# Altium schematic sheet Sheet1.SchDoc: Arduino Uno
size A4; Author: Rubem Vasconcelos Pacelli; Engineer: Engenheiro Eletrônico; DocumentNumber: 2; Revision: 1.0; SheetNumber: 2; SheetTotal: 3
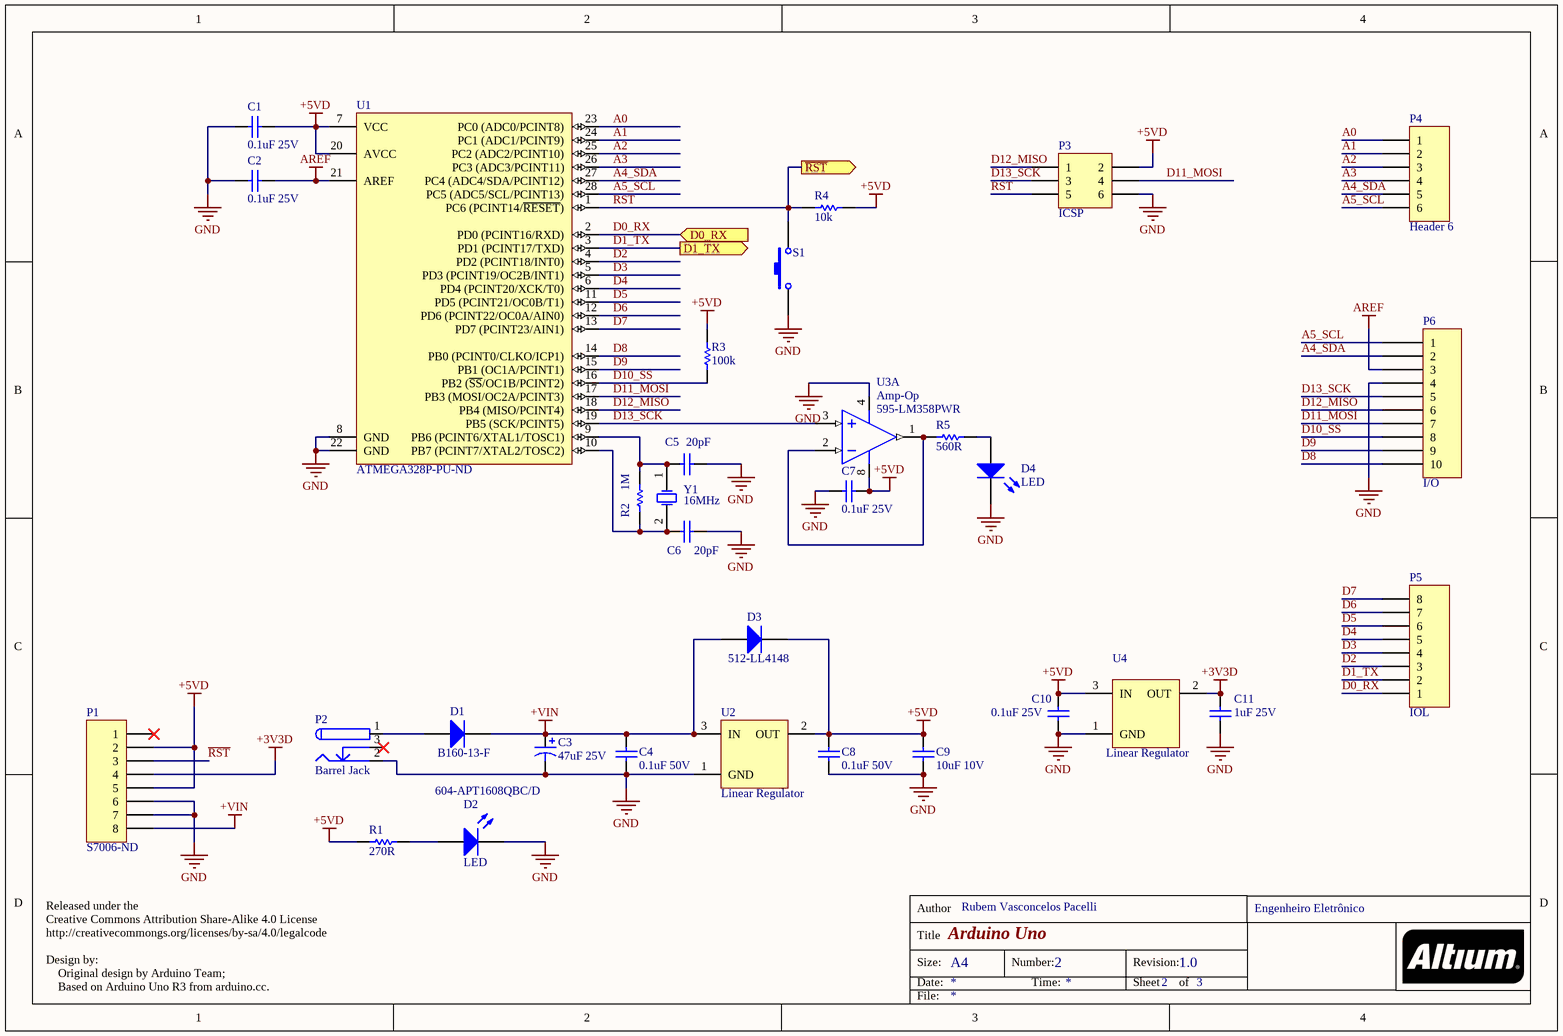
[diagram p0: Sheet1.SchDoc]

## Parts
C1  0.1uF 25V  [C1608[0603]]
C2  0.1uF 25V  [C1608[0603]]
C3  47uF 25V  [Cap_Al_SMD_C6_6.6x6.6mm]
C4  0.1uF 50V  [C1608[0603]]
C5  20pF  [C1608[0603]]
C6  20pF  [C1608[0603]]
C7  0.1uF 25V  [C1608[0603]]
C8  0.1uF 50V  [C1608[0603]]
C9  10uF 10V  [C2012[0805]]
C10  0.1uF 25V  [C1608[0603]]
C11  1uF 25V  [C2012[0805]]
D1  B160-13-F  [DO214AC]
D2  LED  Supplier Part Number 1: 604-APT1608QBC/D  [LED-0603-G]
D3  Supplier Part Number 1: 512-LL4148  [SOD-80/MLL34]
D4  LED  [LED-0603-R]
P1  Supplier Part Number 1: S7006-ND  [HDR1X8F]  (hidden comment: Header 8)
P2  Barrel Jack  [BARREL2.5]
P3  ICSP  [HDR2X3M]
P4  Header 6  [HDR1X6F]
P5  IOL  [HDR1X8F]
P6  I/O  [HDR1X10]
R1  270R  [R1608[0603]]
R2  1M  [R2012[0805]]
R3  100k  [R1608[0603]]
R4  10k  [R1608[0603]]
R5  560R  [R1608[0603]]
S1  (no value)  [PB-SW-SMT]
U1  Supplier Part Number 1: ATMEGA328P-PU-ND  [DIP28]  (hidden comment: ATmega328P-PU)
U2  Linear Regulator  [SOT223_N]
U3  Amp-Op  Supplier Part Number 1: 595-LM358PWR  [TSSOP8]  (part A of 2)
U4  Linear Regulator  [SOT223_N]
Y1  16MHz  [CRYSTAL-HC49/4H_SMX]

## Ports
D0_RX (in), D1_TX (out), ~{RST} (out)

## Nets
+3V3D: C11.2 P1.4 U4.2(OUT)
+5VD: C1.1 C7.1 C8.2 C9.2 C10.2 D3.2(K) P1.2 P1.5 P3.2 R1.1 R3.1 R4.1 U1.7(VCC) U1.20(AVCC) U2.2(OUT) U3.8(V+) U4.3(IN)
+VIN: C3.1 C4.2 D1.2(K) D3.1(A) P1.8 U2.3(IN)
AREF: C2.1 P6.3 U1.21(AREF)
GND: C1.2 C2.2 C3.2 C4.1 C5.2 C6.2 C7.2 C8.1 C9.1 C10.1 C11.1 D2.2(K) D4.2(K) P1.6 P1.7 P2.2 P3.6 P6.4 S1.1 U1.8(GND) U1.22(GND) U2.1(GND) U3.4(GND) U4.1(GND)
A0: P4.1 U1.23(PC0_(ADC0/PCINT8))
A1: P4.2 U1.24(PC1_(ADC1/PCINT9))
A2: P4.3 U1.25(PC2_(ADC2/PCINT10))
A3: P4.4 U1.26(PC3_(ADC3/PCINT11))
A4_SDA: P4.5 P6.2 U1.27(PC4_(ADC4/SDA/PCINT12))
A5_SCL: P4.6 P6.1 U1.28(PC5_(ADC5/SCL/PCINT13))
D0_RX: P5.1 U1.2(PD0_(PCINT16/RXD)) ; port D0_RX
D1_TX: P5.2 U1.3(PD1_(PCINT17/TXD)) ; port D1_TX
D2: P5.3 U1.4(PD2_(PCINT18/INT0))
D3: P5.4 U1.5(PD3_(PCINT19/OC2B/INT1))
D4: P5.5 U1.6(PD4_(PCINT20/XCK/T0))
D5: P5.6 U1.11(PD5_(PCINT21/OC0B/T1))
D6: P5.7 U1.12(PD6_(PCINT22/OC0A/AIN0))
D7: P5.8 U1.13(PD7_(PCINT23/AIN1))
D8: P6.10 U1.14(PB0_(PCINT0/CLKO/ICP1))
D9: P6.9 U1.15(PB1_(OC1A/PCINT1))
D10_SS: P6.8 R3.2 U1.16(PB2_(~{SS}/OC1B/PCINT2))
D11_MOSI: P3.4 P6.7 U1.17(PB3_(MOSI/OC2A/PCINT3))
D12_MISO: P3.1 P6.6 U1.18(PB4_(MISO/PCINT4))
D13_SCK: P3.3 P6.5 U1.19(PB5_(SCK/PCINT5)) U3.3(IN1+)
~{RST}: P1.3 P3.5 R4.2 S1.2 U1.1(PC6_(PCINT14/~{RESET})) ; port ~{RST}
NetC5_1: C5.1 R2.2 U1.9(PB6_(PCINT6/XTAL1/TOSC1)) Y1.1(OSC1)
NetC6_1: C6.1 R2.1 U1.10(PB7_(PCINT7/XTAL2/TOSC2)) Y1.2(OSC2)
NetD1_1: D1.1(A) P2.1
NetD2_1: D2.1(A) R1.2
NetD4_1: D4.1(A) R5.2
NetR5_1: R5.1 U3.1(OUT1) U3.2(IN1-)

Not connected (* = marked no-connect by the designer): P1 1*; P2 3*

## Notes on the sheet
- Released under the
  Creative Commons Attribution Share-Alike 4.0 License
  http://creativecommongs.org/licenses/by-sa/4.0/legalcode
  Design by:
  Original design by Arduino Team;
  Based on Arduino Uno R3 from arduino.cc.
- Author
- Title
- Size:
- Date:
- A4
- Number:
- Time:
- Revision:
- Sheet
- of
- File:

## Library data of the parts
C1 C2 C7 C10 = C: Capacitor Decoupling; Manufacturer Part Number: GCM188R71E104KA57D; Value: 1; Capacitance: 100nF; Tolerance: 10%; Dielectric: X7R; Manufacturer: *; PartNumber: *; Package Type: *; Supplier 1: Digi-Key; Supplier Part Number 1: GCM188R71E104KA57D-ND; Stock 1: 0; Mount: Surface Mount; Case/Package: 0603; Case Code (Imperial): 0603; Case Code (Metric): 1608; Min Operating Temperature: -55°C; Max Operating Temperature: 125°C; Packaging: Tape and Reel; Voltage Rating: 25V; Voltage Rating (DC): 25V; Package Quantity: 4000; Termination: SMD/SMT; Voltage: 25V; Length: 1.6mm; Height: 0.8mm; Width: 0.8mm; Thickness: 0.035inch; Depth: 0.8mm; Ratings: AEC-Q200; Radiation Hardening: No; Lead Free: Lead Free
C3 = CP: Polarized Capacitor - Power Entry; Manufacturer Part Number: EEE-HA1E470WP; Tolerance: 20%; Ripple Current: 70mA; Life (Hours): 1000Hour; Leakage Current: 11.7uA; Lead Diameter: 0.65mm; Manufacturer: *; PartNumber: *; Package Type: *; Value: *; Supplier 1: Digi-Key; Supplier Part Number 1: PCE4206DKR-ND; Stock 1: 156126; Pricing 1: 1=0.43, 10=0.301, 100=0.1808, 500=0.13558 (USD); Mount: Surface Mount; Case/Package: Radial; Contact Plating: Tin; Min Operating Temperature: -40°C; Max Operating Temperature: 105°C; Capacitance: 47uF; Ripple Current (AC): 70mA; Voltage Rating: 25V; Packaging: Tape and Reel; Package Quantity: 1; Voltage Rating (DC): 25V; Termination: SMD/SMT; Voltage: 25V; Diameter: 6.3mm; Length: 5.5mm; Height: 5.4mm; Lead Pitch: 1.8mm; Height - Seated (Max): 0.213inch; Width: 650um; Radiation Hardening: No; REACH SVHC: Unknown; Lead Free: Lead Free; ComponentLink1URL: http://uk.rs-online.com/webdocs/102e/0900766b8102e3f9.pdf; ComponentLink1Description: http://uk.rs-online.com/webdocs/102e/0900766b8102e3f9.pdf; ComponentLink2URL: http://industrial.panasonic.com/www-data/pdf/ABA0000/ABA0000CE3.pdf; ComponentLink2Description: http://industrial.panasonic.com/www-data/pdf/ABA0000/ABA0000CE3.pdf; ComponentLink3URL: http://www.farnell.com/datasheets/1446029.pdf; ComponentLink3Description: http://www.farnell.com/datasheets/1446029.pdf; ComponentLink4URL: http://www.farnell.com/datasheets/2059663.pdf; ComponentLink4Description: http://www.farnell.com/datasheets/2059663.pdf; ComponentLink5URL: https://www.alliedelec.com/m/d/7ecf71cebe655f70ab90926cc286bede.pdf; ComponentLink5Description: https://www.alliedelec.com/m/d/7ecf71cebe655f70ab90926cc286bede.pdf; ComponentLink6URL: http://www.jameco.com/Jameco/Products/ProdDS/1984291.pdf; ComponentLink6Description: http://www.jameco.com/Jameco/Products/ProdDS/1984291.pdf
C4 = C: Decoupling Capacitor; Manufacturer Part Number: C1608X7R1H104M080AA; Value: 1; Dielectric Material: Ceramic; Capacitance: 100nF; Tolerance: 20%; Dielectric: X7R; Manufacturer: *; PartNumber: *; Package Type: *; Supplier 1: Digi-Key; Supplier Part Number 1: 445-5098-6-ND; Stock 1: 0; Pricing 1: 1=0.1, 10=0.074, 100=0.0331, 500=0.02366, 1000=0.0186 (USD); Mount: Surface Mount; Case/Package: 0603; Number of Pins: 2; Weight: 7.1E-05oz; Case Code (Metric): 1608; Case Code (Imperial): 0603; Min Operating Temperature: -55°C; Max Operating Temperature: 125°C; Package Quantity: 1; Voltage Rating: 50V; Packaging: Tape and Reel; Voltage Rating (DC): 50V; Termination: SMD/SMT; Composition: Ceramic; Length: 1.6mm; Height: 0.8mm; Width: 0.031inch; Depth: 0.8mm; Thickness: 0.037inch; Radiation Hardening: No; REACH SVHC: No SVHC; Lead Free: Lead Free; ComponentLink1URL: http://www.farnell.com/datasheets/1571323.pdf; ComponentLink1Description: http://www.farnell.com/datasheets/1571323.pdf; ComponentLink2URL: https://product.tdk.com/info/en/catalog/spec/mlccspec_commercial_general_midvoltage_en.pdf; ComponentLink2Description: https://product.tdk.com/info/en/catalog/spec/mlccspec_commercial_general_midvoltage_en.pdf; ComponentLink3URL: http://www.tdk.co.jp/tefe02/e412_c.pdf; ComponentLink3Description: http://www.tdk.co.jp/tefe02/e412_c.pdf
C5 C6 = C: Capacitor Crystal; Manufacturer Part Number: CL10C200JB8NNNC; Value: 1; Tolerance: 5%; Dielectric: C0G; Voltage Rating: 50V; Temperature Coefficient: 300ppm/°C; Manufacturer: *; PartNumber: *; Package Type: *; Supplier 1: Digi-Key; Supplier Part Number 1: 1276-1187-6-ND; Stock 1: 40000; Pricing 1: 1=0.1, 10=0.048, 100=0.0214, 500=0.01532, 1000=0.01203 (USD); Mount: Surface Mount; Case/Package: 0603; Case Code (Metric): 1608; Case Code (Imperial): 0603; Min Operating Temperature: -55°C; Max Operating Temperature: 125°C; Capacitance: 20pF; Package Quantity: 1; Packaging: Tape and Reel; Voltage: 50V; Length: 1.6mm; Height: 0.8mm; Width: 0.031inch; Thickness: 0.035inch; Depth: 0.8mm; Radiation Hardening: No
C8 = C: Capacitor Decoupling; Manufacturer Part Number: C1608X7R1H104M080AA; Value: 1; Dielectric Material: Ceramic; Capacitance: 100nF; Tolerance: 20%; Dielectric: X7R; Manufacturer: *; PartNumber: *; Package Type: *; Supplier 1: Digi-Key; Supplier Part Number 1: 445-5098-6-ND; Stock 1: 0; Pricing 1: 1=0.1, 10=0.074, 100=0.0331, 500=0.02366, 1000=0.0186 (USD); Mount: Surface Mount; Case/Package: 0603; Number of Pins: 2; Weight: 7.1E-05oz; Case Code (Metric): 1608; Case Code (Imperial): 0603; Min Operating Temperature: -55°C; Max Operating Temperature: 125°C; Package Quantity: 1; Voltage Rating: 50V; Packaging: Tape and Reel; Voltage Rating (DC): 50V; Termination: SMD/SMT; Composition: Ceramic; Length: 1.6mm; Height: 0.8mm; Width: 0.031inch; Depth: 0.8mm; Thickness: 0.037inch; Radiation Hardening: No; REACH SVHC: No SVHC; Lead Free: Lead Free; ComponentLink1URL: http://www.farnell.com/datasheets/1571323.pdf; ComponentLink1Description: http://www.farnell.com/datasheets/1571323.pdf; ComponentLink2URL: https://product.tdk.com/info/en/catalog/spec/mlccspec_commercial_general_midvoltage_en.pdf; ComponentLink2Description: https://product.tdk.com/info/en/catalog/spec/mlccspec_commercial_general_midvoltage_en.pdf; ComponentLink3URL: http://www.tdk.co.jp/tefe02/e412_c.pdf; ComponentLink3Description: http://www.tdk.co.jp/tefe02/e412_c.pdf
C9 = C: Capacitor Decoupling; Manufacturer Part Number: C1608JB1A106K080AC; Value: 1; Dielectric Material: Ceramic; Tolerance: 10%; Manufacturer: *; PartNumber: *; Package Type: *; Supplier 1: Digi-Key; Supplier Part Number 1: 445-11201-6-ND; Stock 1: 22257; Pricing 1: 1=0.62, 10=0.431, 100=0.2588, 500=0.19406, 1000=0.16388 (USD); Mount: Surface Mount; Case/Package: 0603; Case Code (Metric): 1608; Case Code (Imperial): 0603; Min Operating Temperature: -25°C; Max Operating Temperature: 85°C; Package Quantity: 4000; Packaging: Tape and Reel; Capacitance: 10uF; Voltage Rating: 10V; Termination: SMD/SMT; Composition: Ceramic; Voltage Rating (DC): 10V; Length: 0.063inch; Height: 0.8mm; Width: 0.8mm; Thickness: 0.035inch; Lead Free: Lead Free; ComponentLink1URL: https://product.tdk.com/en/products/common/pdf/mlcc_partnumber_description.pdf; ComponentLink1Description: https://product.tdk.com/en/products/common/pdf/mlcc_partnumber_description.pdf
C11 = C: Capacitor Decoupling; Manufacturer: TDK; Manufacturer Part Number: C2012X7R1E105K125AB; Dielectric Material: Ceramic; Tolerance: 10%; Dielectric: X7R; Supplier 1: Digi-Key; Supplier Part Number 1: 445-1354-1-ND; Stock 1: 0; Pricing 1: 1=0.16, 10=0.115, 100=0.054, 500=0.0379, 1000=0.03137 (USD); Mount: Surface Mount; Case/Package: 0805; Number of Pins: 2; Weight: 0.000194oz; Case Code (Imperial): 0805; Case Code (Metric): 2012; Min Operating Temperature: -55°C; Max Operating Temperature: 125°C; Voltage Rating: 25V; Packaging: Tape and Reel; Capacitance: 1uF; Voltage Rating (DC): 25V; Package Quantity: 1; Termination: SMD/SMT; Voltage: 25V; Composition: Ceramic; Length: 2mm; Height: 1.25mm; Width: 1.25mm; Thickness: 0.057inch; Depth: 1.25mm; Radiation Hardening: No; Lead Free: Lead Free; REACH SVHC: No SVHC
D1 = D: Diode; Peak Reverse Current: 500uA; Forward Current: 1A; Max Repetitive Reverse Voltage (Vrrm): 60V; Peak Non-Repetitive Surge Current: 30A; Element Configuration: Single; Forward Voltage: 700mV; Polarity: Standard; Capacitance: 110pF; Manufacturer: *; PartNumber: *; Package Type: *; Supplier 1: Digi-Key; Supplier Part Number 1: B160-FDIDKR-ND; Manufacturer Part Number: B160-13-F; Stock 1: 242650; Pricing 1: 1=0.37, 10=0.304, 100=0.1615, 500=0.10622, 1000=0.07223 (USD); Mount: Surface Mount; Case/Package: SMA; Number of Pins: 2; Weight: 0.002258oz; Contact Plating: Matte,Tin; Min Operating Temperature: -65°C; Max Operating Temperature: 150°C; Package Quantity: 5000; Packaging: Tape and Reel; Average Rectified Current: 1A; Max Forward Surge Current (Ifsm): 30A; Termination: SMD/SMT; Voltage Rating (DC): 60V; Current Rating: 1A; Output Current: 1A; Max Reverse Voltage (DC): 60V; Length: 4.6mm; Height: 2.1mm; Width: 2.92mm; Radiation Hardening: No; REACH SVHC: No SVHC; Lead Free: Lead Free; ComponentLink1URL: https://www.diodes.com/assets/Datasheets/ds13002.pdf; ComponentLink1Description: https://www.diodes.com/assets/Datasheets/ds13002.pdf; ComponentLink2URL: http://www.farnell.com/datasheets/1911815.pdf; ComponentLink2Description: http://www.farnell.com/datasheets/1911815.pdf; ComponentLink3URL: http://www.diodes.com/datasheets/ds13002.pdf; ComponentLink3Description: http://www.diodes.com/datasheets/ds13002.pdf; ComponentLink4URL: http://www.diodes.com///datasheets/ds13002.pdf; ComponentLink4Description: http://www.diodes.com///datasheets/ds13002.pdf
D2 = LED: LED indicador visual; Manufacturer: Kingbright; Manufacturer Part Number: APT1608QBC/D; Color: Blue; Lens Color: Clear,Colorless; Luminous Intensity: 100mcd; Viewing Angle: 120°; Lens Style: Clear,Flat; Forward Current: 20mA; Forward Voltage: 3.3V; Lens Transparency: Clear; Dominant Wavelength: 465nm; Number of LEDs: 1; PartNumber: *; Package Type: *; Supplier 1: Mouser; Stock 1: 33663; Pricing 1: 1=0.49, 10=0.35, 50=0.35, 100=0.229, 1000=0.129, 10000=0.091 (USD); Mount: Surface Mount; Case/Package: 0603; Number of Pins: 2; Case Code (Metric): 1608; Case Code (Imperial): 0603; Min Operating Temperature: -40°C; Max Operating Temperature: 85°C; Package Quantity: 2000; Packaging: Tape and Reel; Illumination Color: Blue; Test Current: 20mA; Length: 1.6mm; Height: 0.75mm; Width: 0.8mm; Lead Free: Lead Free; ComponentLink1URL: http://www.kingbrightusa.com/images/catalog/SPEC/APT1608QBC-D.pdf; ComponentLink1Description: http://www.kingbrightusa.com/images/catalog/SPEC/APT1608QBC-D.pdf; ComponentLink2URL: http://www.mouser.com/ds/2/216/APT1608QBC-D-65281.pdf; ComponentLink2Description: http://www.mouser.com/ds/2/216/APT1608QBC-D-65281.pdf
D3 = D: Diode Protection; Manufacturer Part Number: LL4148; Max Surge Current: 2A; Forward Voltage: 1V; Forward Current: 200mA; Peak Reverse Current: 25nA; Recovery Time: 4ns; Max Repetitive Reverse Voltage (Vrrm): 100V; Power Dissipation: 500mW; Element Configuration: Single; Manufacturer: *; PartNumber: *; Package Type: *; Supplier 1: Mouser; Stock 1: 987975; Pricing 1: 1=0.1, 10=0.087, 50=0.087, 100=0.031, 1000=0.021, 10000=0.014 (USD); Mount: Surface Mount; Number of Pins: 2; Weight: 0.01lb; Contact Plating: Matte,Tin; Min Operating Temperature: -65°C; Max Operating Temperature: 175°C; Packaging: Tape and Reel; Package Quantity: 1; Average Rectified Current: 200mA; Reverse Recovery Time: 4ns; Peak Non-Repetitive Surge Current: 2A; Max Forward Surge Current (Ifsm): 2A; Voltage: 100V; Max Reverse Voltage (DC): 100V; Reverse Voltage: 100V; Current: 2A; Length: 3.6mm; Height: 1.5mm; Width: 1.5mm; Radiation Hardening: No; REACH SVHC: No SVHC; Lead Free: Lead Free; ComponentLink1URL: http://www.farnell.com/datasheets/1730036.pdf; ComponentLink1Description: http://www.farnell.com/datasheets/1730036.pdf; ComponentLink2URL: https://www.fairchildsemi.com/datasheets/LL/LL4148.pdf; ComponentLink2Description: https://www.fairchildsemi.com/datasheets/LL/LL4148.pdf; ComponentLink3URL: http://www.jameco.com/Jameco/Products/ProdDS/94908.pdf; ComponentLink3Description: http://www.jameco.com/Jameco/Products/ProdDS/94908.pdf; ComponentLink4URL: http://www.mouser.com/ds/2/149/LL4148-70504.pdf; ComponentLink4Description: http://www.mouser.com/ds/2/149/LL4148-70504.pdf; ComponentLink5URL: http://www.farnell.com/datasheets/2037793.pdf; ComponentLink5Description: http://www.farnell.com/datasheets/2037793.pdf; ComponentLink6URL: https://www.verical.com/server-webapp/html/getDatasheet?partID=110057; ComponentLink6Description: https://www.verical.com/server-webapp/html/getDatasheet?partID=110057; ComponentLink7URL: http://www.farnell.com/datasheets/1896420.pdf; ComponentLink7Description: http://www.farnell.com/datasheets/1896420.pdf
D4 = LED: Manufacturer Part Number: LTST-C191KRKT; Colour: Red; Lens Colour: Colorless; Power Rating: 75mW; Luminous Intensity: 54mcd; Viewing Angle: 130°; Forward Voltage: 2V; Lens Style: Clear,Colorless,Diffused,Rectangular; Forward Current: 30mA; Dominant Wavelength: 631nm; Test Current: 20mA; Lens Transparency: Clear; Number of Elements: 1; Wavelength: 639nm; Reverse Voltage: 5V; Current: 2A; Manufacturer: *; PartNumber: *; Package Type: *; Supplier 1: Digi-Key; Supplier Part Number 1: 160-1447-6-ND; Stock 1: 978989; Pricing 1: 1=0.29, 10=0.211, 25=0.1556, 100=0.1111, 250=0.07556, 500=0.06666, 1000=0.05222, 2500=0.05111 (USD); Mount: Surface Mount; Case/Package: 0603; Number of Pins: 2; Case Code (Metric): 1608; Case Code (Imperial): 0603; Min Operating Temperature: -55°C; Max Operating Temperature: 85°C; Packaging: Tape and Reel; Package Quantity: 1; Illumination Colour: Red; Power Dissipation: 75mW; Number of LEDs: 1; Voltage: 2V; Length: 1.6mm; Height: 0.55mm; Width: 0.8mm; Depth: 0.8mm; Radiation Hardening: No; Lead Free: Lead Free
P1 P5 = Header 8: Header, 8-Pin; Manufacturer: Sullins; Manufacturer Part Number: PPTC081LFBN-RC; Number of Positions: 8; Connector Type: Header,Socket; Pitch: 0.1inch; LatestRevisionDate: 17-Jul-2002; LatestRevisionNote: Re-released for DXP Platform.; Publisher: Altium Limited; Supplier 1: Digi-Key; Pricing 1: 1=0.65, 10=0.608, 400=0.42525, 800=0.3645, 1200=0.33413, 5200=0.29363, 10000=0.2925 (USD); Mount: Through Hole; Contact Plating: Tin; Contact Material: Bronze; Housing Material: Plastic; Package Quantity: 1000; Number of Rows: 1; Packaging: Bulk; Termination: Solder; Length: 20.8mm; Height: 8.5mm; Width: 2.5mm; Lead Free: Lead Free
  P1: Stock 1: 55095; Color: Black
  P5: Supplier Part Number 1: S7006-ND; Stock 1: 21933; Colour: Black
P2 = PWR2.5: Low Voltage Power Supply Connector; Manufacturer: Memory Protection Devices; Manufacturer Part Number: EJ503A; Pricing 1: 1=2.7, 10=2.447, 100=2.0977, 500=1.74806, 1000=1.49834 (USD); Stock 1: 1084; Supplier 1: Digi-Key; Supplier Part Number 1: EJ503A-ND; Mount: Through Hole
P3 = Header 3X2: Header, 3-Pin, Dual row; Manufacturer: Harwin; Manufacturer Part Number: M20-9720345; Max Current Rating: 3A; Contact Resistance: 25mR; Number of Positions: 6; Gender: Male; Connector Type: Male Pin; Pitch: 2.54mm; Row Spacing: 0.1inch; LatestRevisionDate: 17-Jul-2002; LatestRevisionNote: Re-released for DXP Platform.; Publisher: Altium Limited; Supplier 1: Digi-Key; Supplier Part Number 1: 952-1921-ND; Stock 1: 4637; Pricing 1: 1=0.33, 10=0.308, 100=0.2156, 500=0.1848, 1000=0.154, 5000=0.132, 10000=0.1232 (USD); Mount: Through Hole; Contact Plating: Gold; Colour: Black; Contact Material: Brass; Housing Colour: Black; Housing Material: Nylon; Min Operating Temperature: -40°C; Max Operating Temperature: 105°C; Package Quantity: 1000; Packaging: Bulk; Termination: Solder; Number of Rows: 2; Number of Contacts: 6; Orientation: Straight; Length: 7.62mm; Depth: 5.08mm; Contact Mating Length: 0.276inch; Radiation Hardening: No
P4 = Header 6: Header, 6-Pin; LatestRevisionDate: 17-Jul-2002; LatestRevisionNote: Re-released for DXP Platform.; Publisher: Altium Limited
P6 = Header 10: Header, 10-Pin; Manufacturer: Sullins; Manufacturer Part Number: PPTC101LFBN-RC; Number of Positions: 10; Connector Type: Header,Socket; Pitch: 0.1inch; Supplier 1: Digi-Key; Supplier Part Number 1: S7008-ND; Stock 1: 22268; Pricing 1: 1=0.65, 10=0.574, 320=0.45, 640=0.405, 1280=0.36, 5120=0.325 (USD); Mount: Through Hole; Color: Black; Contact Plating: Tin; Contact Material: Bronze; Housing Material: Plastic; Package Quantity: 1000; Number of Rows: 1; Packaging: Bulk; Termination: Solder; Length: 25.9mm; Height: 8.5mm; Width: 2.5mm; Lead Free: Lead Free
R1 = R: Resistor; Manufacturer: Rohm Semiconductor; Manufacturer Part Number: ESR03EZPJ271; Value: 0; Tolerance: 5%; Max Power Dissipation: 250mW; Temperature Coefficient: 200ppm/°C; PartNumber: *; Package Type: *; Supplier 1: Mouser; Supplier Part Number 1: 755-ESR03EZPJ271; Stock 1: 13313; Pricing 1: 1=0.1, 10=0.071, 50=0.071, 100=0.025, 1000=0.017, 10000=0.011 (USD); Case/Package: 0603; Case Code (Metric): 1608; Case Code (Imperial): 0603; Min Operating Temperature: -55°C; Max Operating Temperature: 155°C; Package Quantity: 5000; Packaging: Cut Tape; Resistance: 270R; Composition: Thick Film; Number of Terminations: 2; Features: Automotive AEC-Q200; Length: 0.063inch; Height: 0.022inch; Width: 0.031inch; ComponentLink1URL: http://www.rohm.com/web/global/datasheet/ESR01MZPF/esr-e; ComponentLink1Description: http://www.rohm.com/web/global/datasheet/ESR01MZPF/esr-e; Mount: Surface Mount
R2 = R: Resistor; Manufacturer Part Number: ERA-6AEB105V; Value: 0; Resistance: 1MR; Tolerance: 1%; Temperature Coefficient: 25ppm/°C; Voltage Rating: 100V; Power Rating: 125mW; Manufacturer: *; PartNumber: *; Package Type: *; Supplier 1: Digi-Key; Supplier Part Number 1: P1MDADKR-ND; Stock 1: 150805; Pricing 1: 1=0.36, 10=0.302, 100=0.1182, 1000=0.04948, 2500=0.04536 (USD); Mount: Surface Mount; Case/Package: 0805; Number of Pins: 2; Contact Plating: Tin; Case Code (Imperial): 0805; Case Code (Metric): 2012; Min Operating Temperature: -55°C; Max Operating Temperature: 155°C; Composition: Thin Film; Packaging: Tape and Reel; Package Quantity: 1; Number of Terminations: 2; Military Standard: Not; Termination: Solder; Max Power Dissipation: 125mW; Voltage Rating (DC): 100V; Working Voltage: 100V; Features: Automotive AEC-Q200; Length: 2mm; Height: 0.5mm; Width: 1.25mm; Depth: 1.25mm; Radiation Hardening: No; REACH SVHC: No SVHC; Lead Free: Lead Free
R3 = R: Resistor pull-up; Manufacturer Part Number: MCT06030C1003FP500; Value: 0; Resistance: 100kR; Tolerance: 1%; Temperature Coefficient: 50ppm/°C; Power Rating: 100mW; Voltage Rating: 75V; Max Power Dissipation: 125mW; Manufacturer: *; PartNumber: *; Package Type: *; Supplier 1: Digi-Key; Supplier Part Number 1: MCT0603-100K-CFDKR-ND; Stock 1: 0; Pricing 1: 1=0.18, 10=0.152, 100=0.0596, 1000=0.02495, 2500=0.02287 (USD); Mount: Surface Mount; Case/Package: 0603; Weight: 7.1E-05oz; Case Code (Metric): 1608; Case Code (Imperial): 0603; Contact Plating: Tin; Min Operating Temperature: -55°C; Max Operating Temperature: 125°C; Packaging: Tape and Reel; Composition: Thin Film; Voltage Rating (DC): 75V; Military Standard: Not; Package Quantity: 1; Number of Terminations: 2; Termination: SMD/SMT; Length: 1.55mm; Height: 0.022inch; Depth: 0.85mm; Width: 0.033inch; Radiation Hardening: No; REACH SVHC: Unknown; Lead Free: Lead Free
R4 = R: Resistor pull-up; Manufacturer Part Number: MCT06030C1002FP500; Value: 0; Resistance: 10kR; Power Rating: 100mW; Tolerance: 1%; Max Power Dissipation: 125mW; Voltage Rating: 75V; Temperature Coefficient: 50ppm/°C; Manufacturer: *; PartNumber: *; Package Type: *; Supplier 1: Digi-Key; Supplier Part Number 1: MCT0603-10.0K-CFDKR-ND; Stock 1: 1373195; Pricing 1: 1=0.18, 10=0.152, 100=0.0596, 1000=0.02495, 2500=0.02287 (USD); Mount: Surface Mount; Case/Package: 0603; Case Code (Imperial): 0603; Case Code (Metric): 1608; Contact Plating: Tin; Min Operating Temperature: -55°C; Max Operating Temperature: 125°C; Packaging: Tape and Reel; Package Quantity: 1; Composition: Thin Film; Military Standard: Not; Voltage Rating (DC): 75V; Number of Terminations: 2; Length: 1.55mm; Height: 0.022inch; Depth: 0.85mm; Width: 0.8mm; Radiation Hardening: No; REACH SVHC: Unknown; Lead Free: Lead Free
R5 = R: Resistor; Manufacturer Part Number: AC0603FR-07560RL; Value: 0; Tolerance: 1%; Voltage Rating: 50V; Power Rating: 100mW; Temperature Coefficient: 100ppm/°C; Manufacturer: *; PartNumber: *; Package Type: *; Supplier 1: Digi-Key; Supplier Part Number 1: YAG3618DKR-ND; Stock 1: 31951; Pricing 1: 1=0.1, 10=0.032, 100=0.0129, 1000=0.00579, 2500=0.00502 (USD); Case/Package: 0603; Weight: 7.1E-05oz; Case Code (Imperial): 0603; Case Code (Metric): 1608; Min Operating Temperature: -55°C; Max Operating Temperature: 155°C; Resistance: 560R; Packaging: Tape and Reel; Composition: Thick Film; Termination: SMD/SMT; Number of Terminations: 2; Max Power Dissipation: 100mW; Features: Automotive AEC-Q200,Moisture Resistant; Length: 0.063inch; Height: 0.022inch; Width: 0.8mm; Lead Free: Lead Free; Mount: Surface Mount
S1 = SW Tact: Tactile Switch; Manufacturer Part Number: PTS645SM43SMTR92LFS; Mechanical Life: 100000Cycles; Actuator Material: Nylon,Polyamide; Max Voltage Rating (DC): 12V; Throw Configuration: SPST; Contact Resistance: 100mR; Operating Force: 160gf; Max Current Rating: 50mA; Illumination Type: Illuminated,Non-Illuminated; Switch Function: Off-Mom; Actuator Type: Standard; Actuator Length: 0.85mm; Manufacturer: *; PartNumber: *; Package Type: *; Supplier 1: Digi-Key; Supplier Part Number 1: CKN9112DKR-ND; Stock 1: 477790; Pricing 1: 1=0.16, 10=0.157, 25=0.1516, 50=0.1462, 100=0.1381, 250=0.12996, 500=0.12452 (USD); Mount: Surface Mount; Case/Package: SMD/SMT; Contact Plating: Silver; Contact Material: Silver; Colour: Black; Min Operating Temperature: -20°C; Max Operating Temperature: 60°C; Packaging: Tape and Reel; Package Quantity: 1000; Current Rating: 50mA; Voltage Rating (DC): 12V; Termination: Gull Wing; Orientation: Straight; Length: 6mm; Depth: 9mm; REACH SVHC: No SVHC; Lead Free: Lead Free
U1 = ATmega328P-PU: 8-bit AVR Microcontroller, 32KB Flash, 1KB EEPROM, 2KB SRAM, 28-pin PDIP, Industrial Grade (-40°C to 85°C); Manufacturer: Microchip / Atmel; Number of PWM Channels: 6; Number of Timers/Counters: 3; Min Supply Voltage: 1.8V; Max Supply Voltage: 5.5V; Interface: 2-Wire,I2C,SPI,UART,USART; Number of I/Os: 23; Frequency: 20MHz; Oscillator Type: Internal; Data Bus Width: 8b; Number of SPI Channels: 1; Watchdog Timer: Yes; Peripherals: Brown-out Detect/Reset,POR,PWM,WDT; DatasheetVersion: revD, May-2011; PackageVersion: revB, Sep-2001; PackageReference: 28P3; PackageDescription: 28-lead (0.300"/7.62mm Wide) Plastic Dual Inline Package (PDIP); ComponentLink1Description: Manufacturer URL; ComponentLink1URL: http://www.atmel.com/; ComponentLink2Description: ATmega48A/48PA/88A/88PA/168A/168PA/328/328P Datasheet; ComponentLink2URL: http://www.atmel.com/dyn/resources/prod_documents/8271.pdf; ComponentLink3Description: ATmega48A/48PA/88A/88PA/168A/168PA/328/328P Summary; ComponentLink3URL: http://www.atmel.com/dyn/resources/prod_documents/8271S.pdf; Supplier 1: Digi-Key; Manufacturer Part Number: ATMEGA328P-PU; Stock 1: 12517; Pricing 1: 1=2.14, 25=1.9672, 100=1.7819 (USD); Mount: Through Hole; Case/Package: PDIP; Number of Pins: 28; Contact Plating: Matte,Tin; Min Operating Temperature: -40°C; Max Operating Temperature: 85°C; Package Quantity: 14; Core Architecture: AVR; RAM Size: 2KB; Number of ADC Channels: 6; Packaging: Rail/Tube; Number of Programmable I/O: 23; Max Frequency: 20MHz; Number of I2C Channels: 1; Memory Type: FLASH; Memory Size: 32KB; Length: 37.4mm; Height: 3.28mm; Width: 6.76mm; Radiation Hardening: No; REACH SVHC: No SVHC; Lead Free: Lead Free; ComponentLink4URL: http://www.farnell.com/datasheets/2047852.pdf; ComponentLink4Description: http://www.farnell.com/datasheets/2047852.pdf; ComponentLink5URL: http://www.rapidonline.com/pdf/73-4283.pdf; ComponentLink5Description: http://www.rapidonline.com/pdf/73-4283.pdf; ComponentLink6URL: http://www.microchip.com/mymicrochip/filehandler.aspx?ddocname=en589968; ComponentLink6Description: http://www.microchip.com/mymicrochip/filehandler.aspx?ddocname=en589968; ComponentLink7URL: http://datasheet.iiic.cc/atmel/ATMEGA328P-PU.pdf; ComponentLink7Description: http://datasheet.iiic.cc/atmel/ATMEGA328P-PU.pdf; ComponentLink8URL: http://www.produktinfo.conrad.com/datenblaetter/150000-174999/155197-da-01-en-MICROCONTR_ATMEGA328P_PU_8BIT_PDIP_28.pdf; ComponentLink8Description: http://www.produktinfo.conrad.com/datenblaetter/150000-174999/155197-da-01-en-MICROCONTR_ATMEGA328P_PU_8BIT_PDIP_28.pdf
U2 = Regulator: 5V supplier; Manufacturer Part Number: NCP1117ST50T3G; Number of Outputs: 1; Max Input Voltage: 20V; Output Current: 1A; Min Input Voltage: 3.5V; Dropout Voltage: 1.2V; Input Bias Current: 6mA; Polarity: Positive; Quiescent Current: 10mA; Output Voltage Accuracy: 1%; Power Rating: 781mW; Output Type: Fixed; Manufacturer: *; Package Type: *; PartNumber: *; Supplier 1: Digi-Key; Supplier Part Number 1: NCP1117ST50T3GOSDKR-ND; Stock 1: 10748; Pricing 1: 1=0.54, 10=0.458, 100=0.3423, 500=0.26896, 1000=0.20783 (USD); Case/Package: SOT-223; Number of Pins: 4; Contact Plating: Matte,Tin; Min Operating Temperature: 0°C; Max Operating Temperature: 125°C; Package Quantity: 1; Output Voltage: 5V; Max Output Current: 1A; Nominal Output Voltage: 5V; Packaging: Tape and Reel; Number of Regulators: 1; Min Current Limit: 1A; Accuracy: 1%; Tolerance: 1%; Length: 6.7mm; Height: 1.69mm; Width: 3.7mm; Radiation Hardening: No; REACH SVHC: No SVHC; Lead Free: Lead Free; Halogen Free: Halogen Free; ComponentLink1URL: http://www.onsemi.com/pub/Collateral/NCP1117-D.PDF; ComponentLink1Description: http://www.onsemi.com/pub/Collateral/NCP1117-D.PDF; ComponentLink2URL: http://www.onsemi.ru.com/pub/Collateral/NCP1117-D.PDF; ComponentLink2Description: http://www.onsemi.ru.com/pub/Collateral/NCP1117-D.PDF; ComponentLink3URL: http://www.farnell.com/datasheets/1748260.pdf; ComponentLink3Description: http://www.farnell.com/datasheets/1748260.pdf; ComponentLink4URL: http://www.onsemi.com/pub_link/Collateral/NCP1117-D.PDF; ComponentLink4Description: http://www.onsemi.com/pub_link/Collateral/NCP1117-D.PDF; ComponentLink5URL: http://www.farnell.com/datasheets/1878391.pdf; ComponentLink5Description: http://www.farnell.com/datasheets/1878391.pdf; Mount: Surface Mount
U3 = LM358PWR: Manufacturer: Texas Instruments; Number of Channels: 2; Gain Bandwidth Product: 700kHz; Slew Rate: 0.3V/µs; Output Current: 30mA; Nominal Supply Current: 1.2mA; Input Bias Current: 250nA; Input Offset Voltage (Vos): 7mV; Operating Supply Current: 1mA; Min Supply Voltage: 3V; Max Supply Voltage: 32V; Voltage Gain: 100dB; Common Mode Rejection Ratio: 65dB; Min Dual Supply Voltage: 1.5V; Max Dual Supply Voltage: 16V; Quiescent Current: 600mA; Supplier 1: Mouser; Manufacturer Part Number: LM358PWR; Stock 1: 5361; Pricing 1: 1=0.38, 10=0.284, 50=0.284, 100=0.154, 1000=0.116, 10000=0.093 (USD); Mount: Surface Mount; Case/Package: TSSOP; Number of Pins: 8; Min Operating Temperature: 0°C; Max Operating Temperature: 70°C; Packaging: Tape and Reel; Number of Circuits: 2; Output Current per Channel: 30mA; Package Quantity: 1; Bandwidth: 700kHz; Unity Gain Bandwidth Product: 700kHz; Number of Elements: 2; Operating Supply Voltage: 16V; Number of Amplifiers: 2; Radiation Hardening: No; Lead Free: Lead Free; REACH SVHC: No SVHC; ComponentLink1URL: http://www.ti.com/lit/ds/symlink/lm358.pdf; ComponentLink1Description: http://www.ti.com/lit/ds/symlink/lm358.pdf; ComponentLink2URL: http://www.produktinfo.conrad.com/datenblaetter/1000000-1099999/001072378-da-01-en-IC_OPAMP_GP_700KHZ_LM358PWR_TSSOP_8_TID.pdf; ComponentLink2Description: http://www.produktinfo.conrad.com/datenblaetter/1000000-1099999/001072378-da-01-en-IC_OPAMP_GP_700KHZ_LM358PWR_TSSOP_8_TID.pdf
U4 = Regulator: 3V3 supplier; Manufacturer: ON Semiconductor; Manufacturer Part Number: NCP1117ST33T3G; Output Voltage: 3.3V; Max Input Voltage: 20V; Number of Outputs: 1; Dropout Voltage: 1.07V; Output Current: 1A; Max Supply Voltage: 15V; Min Supply Voltage: 4.75V; Min Input Voltage: 3.5V; Input Bias Current: 6mA; Quiescent Current: 10mA; Polarity: Positive; Reference Voltage: 1.25V; Accuracy: 1%; Output Type: Fixed; Supplier 1: Digi-Key; Supplier Part Number 1: NCP1117ST33T3GOSDKR-ND; Stock 1: 58869; Pricing 1: 1=0.52, 10=0.444, 100=0.3315, 500=0.26048, 1000=0.20129 (USD); Mount: Surface Mount; Case/Package: SOT-223; Number of Pins: 3; Contact Plating: Matte,Tin; Min Operating Temperature: 0°C; Max Operating Temperature: 125°C; Packaging: Tape and Reel; Max Output Current: 1A; Package Quantity: 1; Nominal Output Voltage: 3.3V; Number of Regulators: 1; Min Current Limit: 1A; Min Output Voltage: 3.3V; Max Output Voltage: 3.3V; Termination: SMD/SMT; Output Voltage Accuracy: 1%; Length: 6.7mm; Height: 1.69mm; Width: 3.7mm; Radiation Hardening: No; REACH SVHC: No SVHC; Lead Free: Lead Free; Halogen Free: Halogen Free
Y1 = XTAL: Crystal Oscillator; Manufacturer Part Number: ECS-160-20-3X-TR; Frequency Tolerance: 30ppm; Load Capacitance: 20pF; ESR (Equivalent Series Resistance): 50R; Frequency Stability: 50ppm; Manufacturer: *; PartNumber: *; Package Type: *; Supplier 1: Digi-Key; Supplier Part Number 1: XC1776DKR-ND; Stock 1: 30831; Pricing 1: 1=0.38, 10=0.316, 50=0.2846, 100=0.253, 500=0.24036, 1000=0.2024 (USD); Mount: Surface Mount; Min Operating Temperature: -10°C; Max Operating Temperature: 70°C; Package Quantity: 1; Frequency: 16MHz; Packaging: Tape and Reel; Tolerance: 30ppm; Termination: SMD/SMT; Length: 0.276inch; Height: 0.091inch; Width: 0.161inch; Lead Free: Lead Free; Case/Package: HC-49/US